# Altium project EECS498Converter.PrjPcb
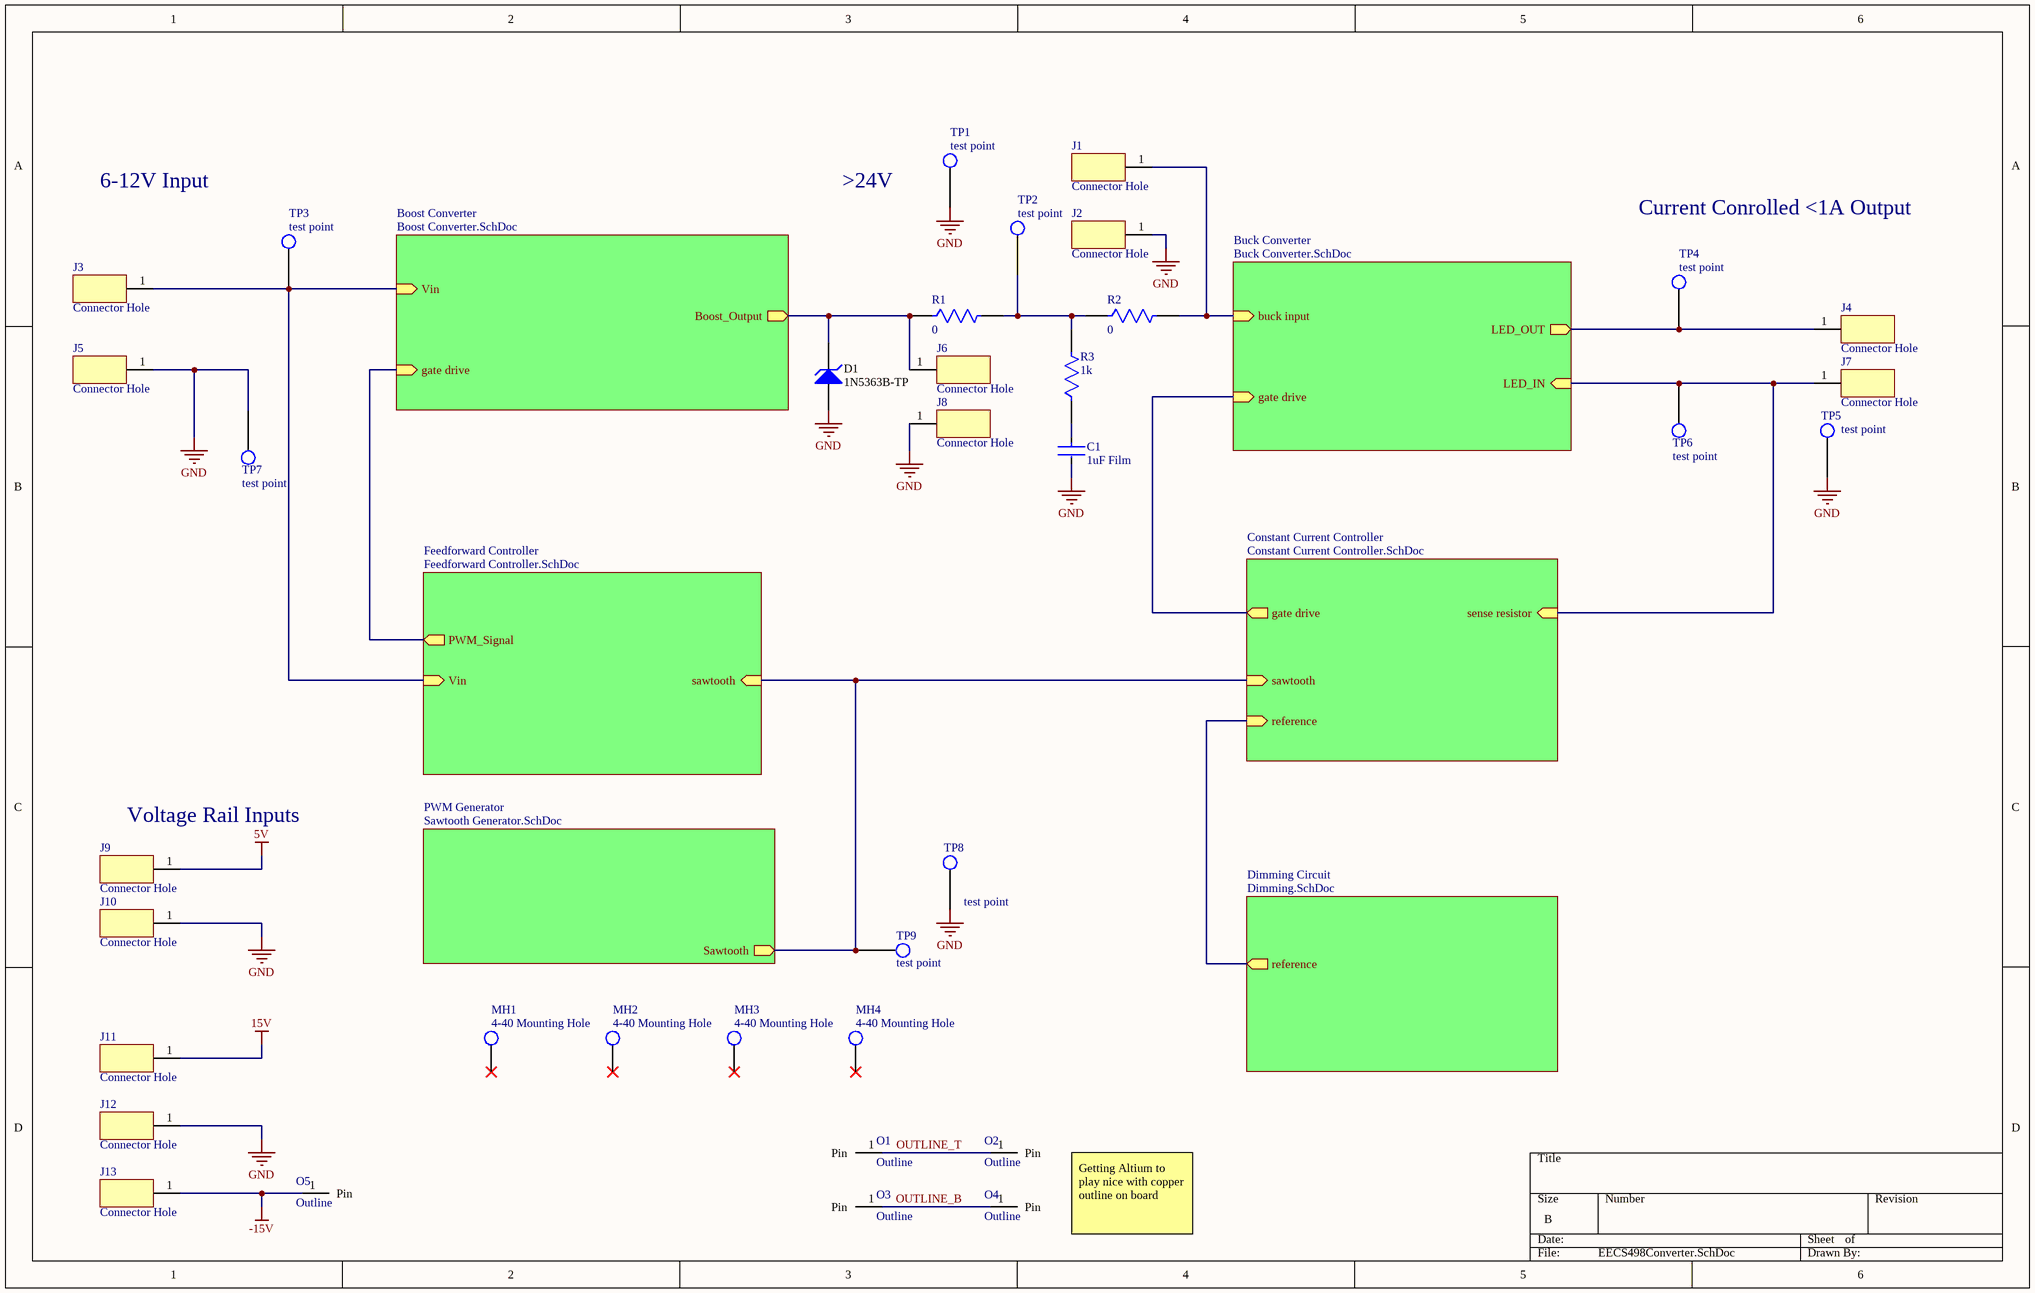
[diagram p0: EECS498Converter.SchDoc]
7 sheets, 148 parts. Net scope: hierarchical (ports join the sheet entries above them; power ports are global).
Board file: EECS498Converter.PcbDoc
Sheets:
  EECS498Converter.SchDoc
    Boost Converter = Boost Converter.SchDoc
    Buck Converter = Buck Converter.SchDoc
    Constant Current Controller = Constant Current Controller.SchDoc
    Feedforward Controller = Feedforward Controller.SchDoc
    Dimming Circuit = Dimming.SchDoc
    PWM Generator = Sawtooth Generator.SchDoc

## Sheet EECS498Converter.SchDoc
size B; SheetNumber: 1; SheetTotal: 7

### Parts
C1  1uF Film  [FP-FILM-CAP-10mm]
D1  1N5363B-TP  [1N5363B-TP]
J1  Connector Hole  [Connector Hole]
J2  Connector Hole  [Connector Hole]
J3  Connector Hole  [Connector Hole]
J4  Connector Hole  [Connector Hole]
J5  Connector Hole  [Connector Hole]
J6  Connector Hole  [Connector Hole]
J7  Connector Hole  [Connector Hole]
J8  Connector Hole  [Connector Hole]
J9  Connector Hole  [Connector Hole]
J10  Connector Hole  [Connector Hole]
J11  Connector Hole  [Connector Hole]
J12  Connector Hole  [Connector Hole]
J13  Connector Hole  [Connector Hole]
MH1  4-40 Mounting Hole  [4-40 Mounting Hole]
MH2  4-40 Mounting Hole  [4-40 Mounting Hole]
MH3  4-40 Mounting Hole  [4-40 Mounting Hole]
MH4  4-40 Mounting Hole  [4-40 Mounting Hole]
O1  Outline
O2  Outline
O3  Outline
O4  Outline
O5  Outline
R1  0  [FP-RLR07-MFG]
R2  0  [FP-RLR07-MFG]
R3  1k  [FP-RLR07-MFG]
TP1  test point  [test point]
TP2  test point  [test point]
TP3  test point  [test point]
TP4  test point  [test point]
TP5  test point  [test point]
TP6  test point  [test point]
TP7  test point  [test point]
TP8  test point  [test point]
TP9  test point  [test point]

### Sub-sheets
Boost Converter = Boost Converter.SchDoc: Vin (in), gate drive (in), Boost_Output (out)
Buck Converter = Buck Converter.SchDoc: buck input (in), gate drive (in), LED_IN (in), LED_OUT (out)
Constant Current Controller = Constant Current Controller.SchDoc: sense resistor (in), gate drive (out), reference (in), sawtooth (in)
Dimming Circuit = Dimming.SchDoc: reference (out)
Feedforward Controller = Feedforward Controller.SchDoc: Vin (in), PWM_Signal (out), sawtooth (in)
PWM Generator = Sawtooth Generator.SchDoc: Sawtooth (out)

### Nets
5V: J9.1
15V: J11.1
-15V: J13.1 O5.1(Pin)
GND: C1.2 D1.1(A) J2.1 J5.1 J8.1 J10.1 J12.1 TP1.1 TP5.1 TP7.1 TP8.1
OUTLINE_B: O3.1(Pin) O4.1(Pin)
OUTLINE_T: O1.1(Pin) O2.1(Pin)
NetC1_1: C1.1 R3.1
NetC2_1: J3.1 TP3.1 ; sheet Boost Converter/Vin, sheet Feedforward Controller/Vin
NetC3_1: D1.2(K) J6.1 R1.1 ; sheet Boost Converter/Boost_Output
NetC7_1: J4.1 TP4.1 ; sheet Buck Converter/LED_OUT
NetC7_2: J7.1 TP6.1 ; sheet Buck Converter/LED_IN, sheet Constant Current Controller/sense resistor
NetC32_1: sheet Constant Current Controller/reference, sheet Dimming Circuit/reference
NetJ1_1: J1.1 R2.2 ; sheet Buck Converter/buck input
NetR1_2: R1.2 R2.1 R3.2 TP2.1
NetR16_1: sheet Boost Converter/gate drive, sheet Feedforward Controller/PWM_Signal
NetR17_2: TP9.1 ; sheet Constant Current Controller/sawtooth, sheet Feedforward Controller/sawtooth, sheet PWM Generator/Sawtooth
NetR19_1: sheet Buck Converter/gate drive, sheet Constant Current Controller/gate drive

Not connected (* = marked no-connect by the designer): MH1 1*; MH2 1*; MH3 1*; MH4 1*

### Notes on the sheet
- 6-12V Input
- >24V
- Current Conrolled <1A Output
- (near J9) Voltage Rail Inputs
- Getting Altium to play nice with copper outline on board

### Library data of the parts
C1 = 1uf Capacitor: CAP CER 1UF 50V X7R FILM; Capacitance: 100nF; Tolerance: 10%; Dielectric Material: Ceramic; Lead Length: 30mm; Lead Diameter: 0.5mm; Lead/Base Style: Formed Leads; Diameter: 500um; Max Operating Temperature: 125°C; Case/Package: Dipped; Dielectric: X7R; Lead Free: Lead Free; Construction: RADIAL; Voltage: 50V; Thickness: 2.6mm; Min Operating Temperature: -55°C; Lead Pitch: 5mm; Height: 4mm; Radiation Hardening: No; Voltage Rating: 50V; Depth: 2.5mm; Voltage Rating (DC): 50V; Package Quantity: 1; Weight: 0.005644oz; Series: K; Mount: Through Hole; Termination: Radial; Height - Seated (Max): 0.257inch; Length: 4mm; Packaging: Tape and Reel; Width: 2.5mm; RoHS Compliant: Yes
D1 = 1N5363B-TP: Zener Diode 30V 5W THT; PartNumber: 1N4742A; Manufacturer: Fairchild Semiconductor; Tolerance: 5%; PD (W): 1; VZ (Min.) (V): 11.4; VZ (Max.) (V): 12.6; ZZ (Max) (ohm): 8; IR (uA): 5; Test Current IZ (mA): 21; PackageVersion: Rev. 2; DatasheetVersion: Rev. H3; Mounting Technology: Through Hole; PackageDescription: 2-Pin Axial leaded, Body 2.72 x 5.2 mm, Lead Spread 25.4 mm; ComponentLink1Description: Manufacturer URL; ComponentLink3Description: Package Specification; ComponentLink2Description: Datasheet; ComponentLink2URL: http://www.fairchildsemi.com/ds/1N/1N4744A.pdf; PackageReference: DO-41-2; RoHS: TRUE; Operating and Storage Temperature Range: -65 to 200 degC; ComponentLink3URL: http://www.fairchildsemi.com/dwg/DO/DO41A.pdf; ComponentLink1URL: http://www.fairchildsemi.com/
R1-R3 = Resistor: Resistor, ± 1%, 250 mW, Axial Leaded, Metal Film, Military Reliability; NexarPartId: 39453770; Max Power Dissipation: 250mW; Resistance: 100kΩ; Lead Length: 38.1mm; Voltage Rating: 250V; Lead Diameter: 640µm; Temperature Coefficient: 100ppm/°C; Wire/Cable Diameter: 50.8µm; Military Standard: MIL-PRF-39017; REACH SVHC: Unknown; Min Operating Temperature: -65°C; Length: 7.62mm; Case/Package: Axial; Lead Free: Contains Lead; Height: 2.5mm; Contact Plating: Lead, Tin; Radiation Hardening: No; Composition: Metal Film; Voltage Rating (DC): 250V; Schedule B: 8533210090, 8533210090|8533210090, 8533210090|8533210090|8533210090, 8533210090|8533210090|8533210090|8533210090; Diameter: 2.29mm; Tolerance: 1%; Max Operating Temperature: 150°C; Number of Terminations: 2; RoHS: Non-Compliant; Features: Military, Moisture Resistant, Weldable; Power Rating: 250mW; Packaging: Bulk; Width: 2.29mm; Termination: Axial; Failure Rate: 0.001%

## Sheet Boost Converter.SchDoc
size B; SheetNumber: 2; SheetTotal: 7
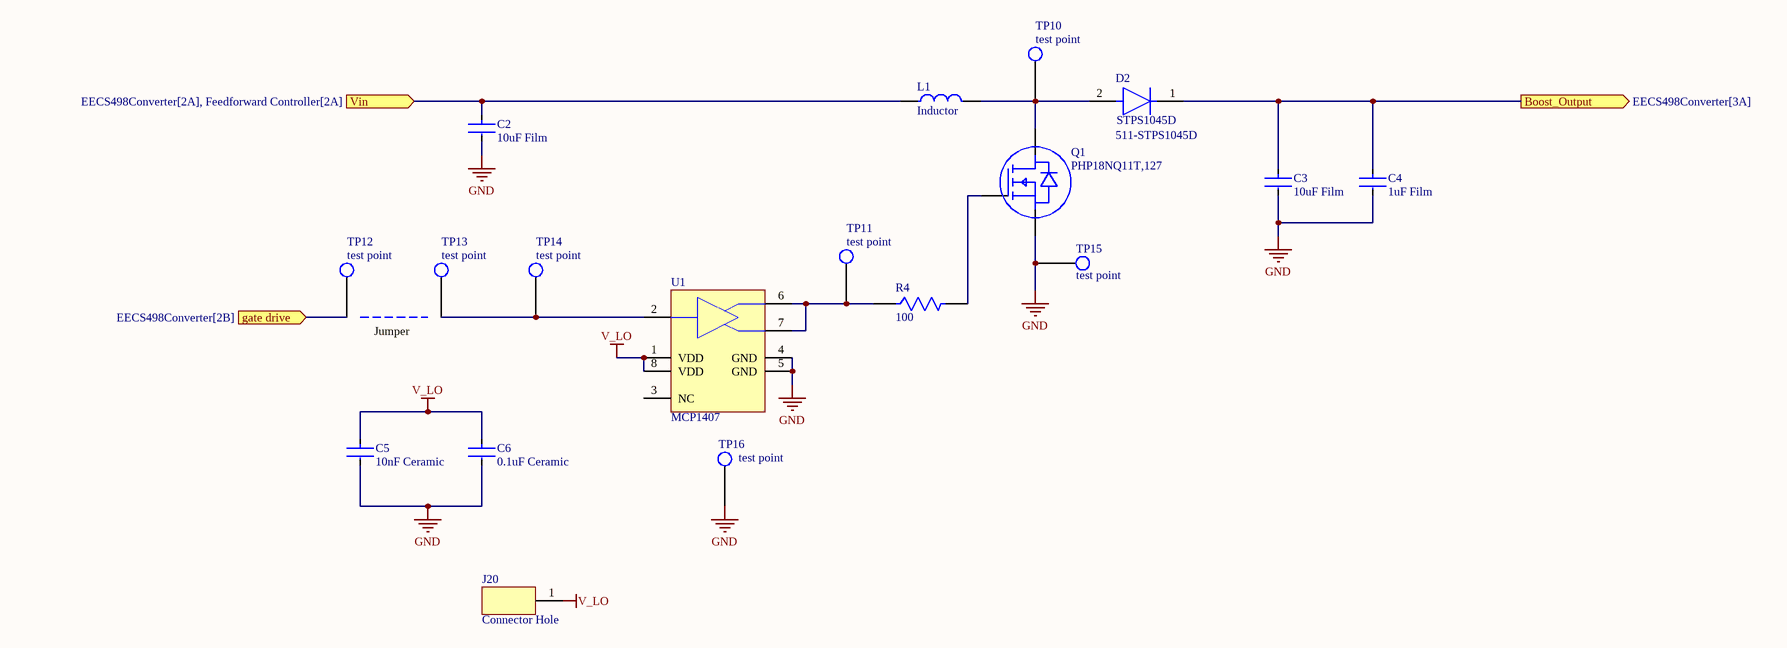
[diagram p1: Boost Converter.SchDoc]

### Parts
C2  10uF Film  [FP-FILM-CAP-22.5mm]
C3  10uF Film  [FP-FILM-CAP-22.5mm]
C4  1uF Film  [FP-FILM-CAP-10mm]
C5  10nF Ceramic  [FP-K15H5-MFG]
C6  0.1uF Ceramic  [FP-K15H5-MFG]
D2  STPS1045D  Supplier Part Number 1: 511-STPS1045D  [STPS1045D]
J20  Connector Hole  [Connector Hole]
L1  Inductor  [Power Inductor]
Q1  PHP18NQ11T,127  [1727-PHP18NQ11T,127-ND]
R4  100  [FP-RLR07-MFG]
TP10  test point  [test point]
TP11  test point  [test point]
TP12  test point  [test point]
TP13  test point  [test point]
TP14  test point  [test point]
TP15  test point  [test point]
TP16  test point  [test point]
U1  MCP1407  [DIP8]

### Ports
Boost_Output (out, see EECS498Converter[3A]), gate drive (in, see EECS498Converter[2B]), Vin (in, see EECS498Converter[2A], Feedforward Controller[2A])

### Nets
GND: C2.2 C3.2 C4.2 C5.2 C6.2 Q1.3(S) TP15.1 TP16.1 U1.4(GND) U1.5(GND)
V_LO: C5.1 C6.1 J20.1 U1.1(VDD) U1.8(VDD)
NetC2_1: C2.1 L1.1 ; port Vin
NetC3_1: C3.1 C4.1 D2.1(K) ; port Boost_Output
NetD2_2: D2.2(A) L1.2 Q1.2(D) TP10.1
NetQ1_1: Q1.1(G) R4.2
NetR4_1: R4.1 TP11.1 U1.6(OUT) U1.7(OUT)
NetR16_1: TP12.1 ; port gate drive
NetTP13_1: TP13.1 TP14.1 U1.2(IN)

Not connected (* = marked no-connect by the designer): U1 3(NC)

### Notes on the sheet
- Jumper

### Library data of the parts
C2 C3 = 10uF Capacitor: CAP CER 10UF 50V X7R FILM; Capacitance: 100nF; Tolerance: 10%; Dielectric Material: Ceramic; Lead Length: 30mm; Lead Diameter: 0.5mm; Lead/Base Style: Formed Leads; Diameter: 500um; Max Operating Temperature: 125°C; Case/Package: Dipped; Dielectric: X7R; Lead Free: Lead Free; Construction: RADIAL; Voltage: 50V; Thickness: 2.6mm; Min Operating Temperature: -55°C; Lead Pitch: 5mm; Height: 4mm; Radiation Hardening: No; Voltage Rating: 50V; Depth: 2.5mm; Voltage Rating (DC): 50V; Package Quantity: 1; Weight: 0.005644oz; Series: K; Mount: Through Hole; Termination: Radial; Height - Seated (Max): 0.257inch; Length: 4mm; Packaging: Tape and Reel; Width: 2.5mm; RoHS Compliant: Yes
C4 = 1uf Capacitor: as C1 on sheet EECS498Converter; Diameter: 500um; Max Operating Temperature: 125°C; Case/Package: Dipped; Dielectric: X7R; Lead Free: Lead Free; Construction: RADIAL; Voltage: 50V; Thickness: 2.6mm; Min Operating Temperature: -55°C; Lead Pitch: 5mm; Height: 4mm; Radiation Hardening: No; Voltage Rating: 50V; Depth: 2.5mm; Voltage Rating (DC): 50V; Package Quantity: 1; Weight: 0.005644oz; Series: K; Mount: Through Hole; Termination: Radial; Height - Seated (Max): 0.257inch; Length: 4mm; Packaging: Tape and Reel; Width: 2.5mm; RoHS Compliant: Yes
C5 = 10nF Capacitor: CAP CER 10nF 50V X7R RADIAL; Capacitance: 100nF; Tolerance: 10%; Lead Length: 30mm; Lead Diameter: 0.5mm; Lead/Base Style: Formed Leads; Diameter: 500um; Max Operating Temperature: 125°C; Dielectric Material: Ceramic; Case/Package: Dipped; Dielectric: X7R; Lead Free: Lead Free; Construction: RADIAL; Voltage: 50V; Thickness: 2.6mm; Min Operating Temperature: -55°C; Lead Pitch: 5mm; Height: 4mm; Radiation Hardening: No; Voltage Rating: 50V; Depth: 2.5mm; Voltage Rating (DC): 50V; Package Quantity: 1; Weight: 0.005644oz; Series: K; Mount: Through Hole; Termination: Radial; Height - Seated (Max): 0.257inch; Length: 4mm; Packaging: Tape and Reel; Width: 2.5mm; RoHS Compliant: Yes
C6 = 0.1uF Capacitor: CAP CER 0.1UF 50V X7R RADIAL; Capacitance: 100nF; Tolerance: 10%; Lead Length: 30mm; Lead Diameter: 0.5mm; Lead/Base Style: Formed Leads; Diameter: 500um; Max Operating Temperature: 125°C; Dielectric Material: Ceramic; Case/Package: Dipped; Dielectric: X7R; Lead Free: Lead Free; Construction: RADIAL; Voltage: 50V; Thickness: 2.6mm; Min Operating Temperature: -55°C; Lead Pitch: 5mm; Height: 4mm; Radiation Hardening: No; Voltage Rating: 50V; Depth: 2.5mm; Voltage Rating (DC): 50V; Package Quantity: 1; Weight: 0.005644oz; Series: K; Mount: Through Hole; Termination: Radial; Height - Seated (Max): 0.257inch; Length: 4mm; Packaging: Tape and Reel; Width: 2.5mm; RoHS Compliant: Yes
D2 = STPS1045D: Diode 45 V 10A Through Hole TO-220AC; Supplier 1: Mouser
L1 = Inductor: DC Current: 180mA; Tolerance: 10%; Core Material: Ferrite; Q Factor: 27; Self Resonant Frequency: 25MHz; Shielding: Unshielded; Test Frequency: 1MHz; Inductance: 10uH; Series Resistance: 1.6R; Radiation Hardening: No; REACH SVHC: No SVHC; Width: 0.098inch; RoHS Compliant: Yes; Case/Package: 1210; Package Quantity: 2000; Height - Seated (Max): 0.083inch; Rated Current-Max: 180mA; Series: SIMID; Mount: Surface Mount; Depth: 2.8mm; Resistor Type: Wirewound; Max DC Current: 180mA; Termination: SMD/SMT; Contact Plating: Tin; Height: 2.1mm; Case Code (Metric): 3225; Lead Free: Lead Free; Weight: 0.001764oz; Max Operating Temperature: 125°C; Length: 3.5mm; Packaging: Tape and Reel; Case Code (Imperial): 1210; Inductance Tolerance: 10%; Ratings: AEC-Q200; Number of Pins: 2; Current Rating: 180mA; Military Standard: Not; DC Resistance (DCR): 1.6R
Q1 = PHP18NQ11T,127: N-Channel 110 V 18A (Tc) 79W (Tc) Through Hole TO-220AB; Supplier 1: Digi-Key; Supplier Part Number 1: 1727-PHP18NQ11T,127-ND
R4 = Resistor: as R1 on sheet EECS498Converter; Military Standard: MIL-PRF-39017; REACH SVHC: Unknown; Min Operating Temperature: -65°C; Length: 7.62mm; Case/Package: Axial; Lead Free: Contains Lead; Height: 2.5mm; Contact Plating: Lead, Tin; Radiation Hardening: No; Composition: Metal Film; Voltage Rating (DC): 250V; Schedule B: 8533210090, 8533210090|8533210090, 8533210090|8533210090|8533210090, 8533210090|8533210090|8533210090|8533210090; Diameter: 2.29mm; Tolerance: 1%; Max Operating Temperature: 150°C; Number of Terminations: 2; RoHS: Non-Compliant; Features: Military, Moisture Resistant, Weldable; Power Rating: 250mW; Packaging: Bulk; Width: 2.29mm; Termination: Axial; Failure Rate: 0.001%
U1 = MCP1407: 6A High-Speed Power MOSFET Drivers, Non Inverting, Extended Temperature; PackageVersion: revBB, Aug-2009; PackageReference: PDIP300-P8; Code_JEDEC: MS-001; PackageDescription: 8-Lead Plastic Dual In-Line (P) - 300 mil Body [PDIP]; DatasheetVersion: revA, Dec-2006

## Sheet Buck Converter.SchDoc
size B; SheetNumber: 3; SheetTotal: 7
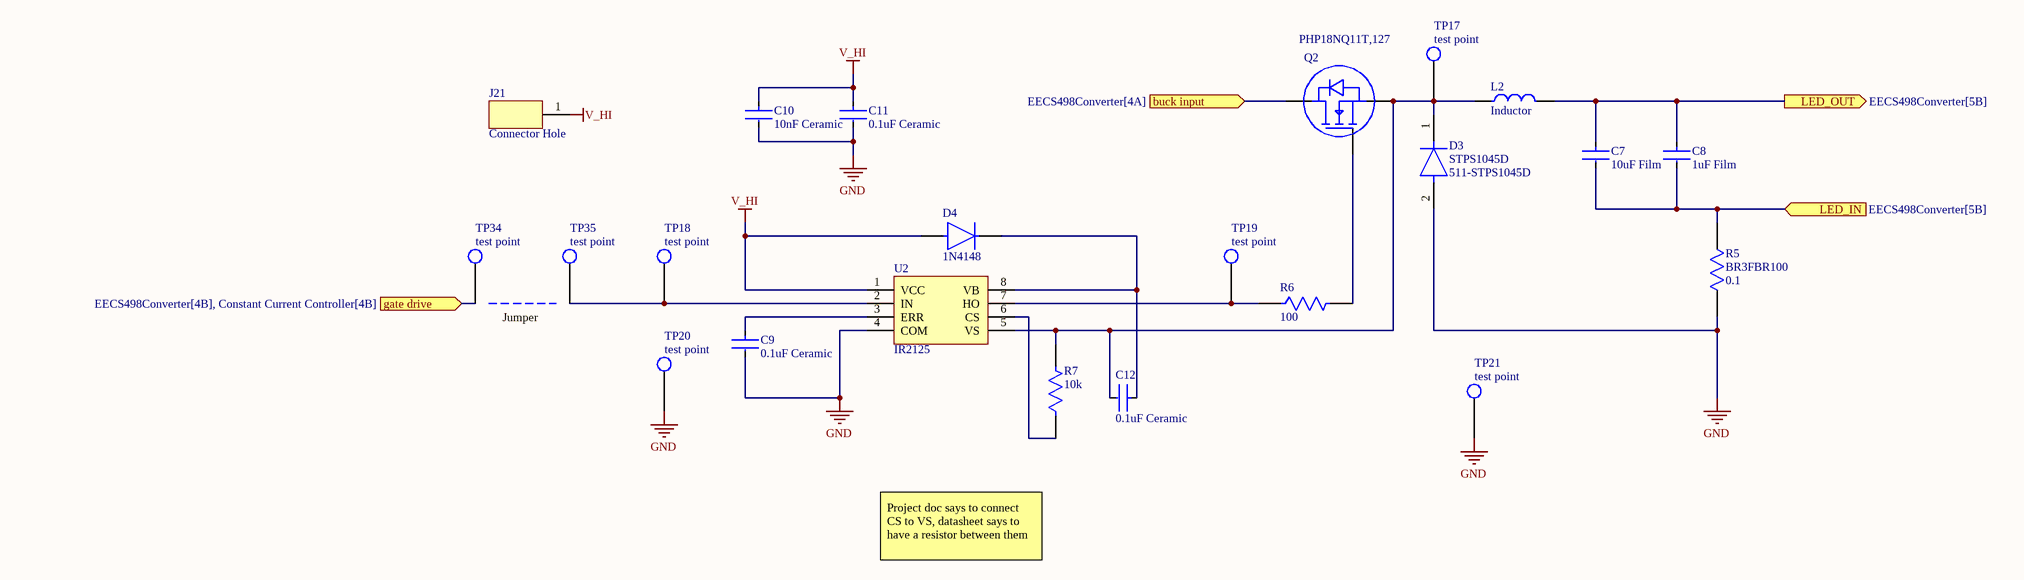
[diagram p2: Buck Converter.SchDoc]

### Parts
C7  10uF Film  [FP-FILM-CAP-22.5mm]
C8  1uF Film  [FP-FILM-CAP-10mm]
C9  0.1uF Ceramic  [FP-K15H5-MFG]
C10  10nF Ceramic  [FP-K15H5-MFG]
C11  0.1uF Ceramic  [FP-K15H5-MFG]
C12  0.1uF Ceramic  [FP-K15H5-MFG]
D3  STPS1045D  Supplier Part Number 1: 511-STPS1045D  [STPS1045D]
D4  1N4148  [FP-1N4148-MFG]
J21  Connector Hole  [Connector Hole]
L2  Inductor  [Power Inductor]
Q2  PHP18NQ11T,127  [1727-PHP18NQ11T,127-ND]
R5  BR3FBR100  value 0.1  [BR3FBR100]
R6  100  [FP-RLR07-MFG]
R7  10k  [FP-RLR07-MFG]
TP17  test point  [test point]
TP18  test point  [test point]
TP19  test point  [test point]
TP20  test point  [test point]
TP21  test point  [test point]
TP34  test point  [test point]
TP35  test point  [test point]
U2  IR2125  [DIP8]

### Ports
buck input (in, see EECS498Converter[4A]), gate drive (in, see EECS498Converter[4B], Constant Current Controller[4B]), LED_IN (in, see EECS498Converter[5B]), LED_OUT (out, see EECS498Converter[5B])

### Nets
GND: C9.2 C10.2 C11.2 D3.2(A) R5.1 TP20.1 TP21.1 U2.4(COM)
V_HI: C10.1 C11.1 D4.2(A) J21.1 U2.1(VCC)
NetC7_1: C7.1 C8.1 L2.2 ; port LED_OUT
NetC7_2: C7.2 C8.2 R5.2 ; port LED_IN
NetC9_1: C9.1 U2.3(ERR)
NetC12_1: C12.1 D4.1(C) U2.8(VB)
NetC12_2: C12.2 D3.1(K) L2.1 Q2.3(S) R7.2 TP17.1 U2.5(VS)
NetJ1_1: Q2.2(D) ; port buck input
NetQ2_1: Q2.1(G) R6.2
NetR6_1: R6.1 TP19.1 U2.7(HO)
NetR7_1: R7.1 U2.6(CS)
NetR19_1: TP34.1 ; port gate drive
NetTP18_1: TP18.1 TP35.1 U2.2(IN)

### Notes on the sheet
- Jumper
- Project doc says to connect CS to VS, datasheet says to have a resistor between them

### Library data of the parts
C7 = 10uF Capacitor: as C2 on sheet Boost Converter; Diameter: 500um; Max Operating Temperature: 125°C; Case/Package: Dipped; Dielectric: X7R; Lead Free: Lead Free; Construction: RADIAL; Voltage: 50V; Thickness: 2.6mm; Min Operating Temperature: -55°C; Lead Pitch: 5mm; Height: 4mm; Radiation Hardening: No; Voltage Rating: 50V; Depth: 2.5mm; Voltage Rating (DC): 50V; Package Quantity: 1; Weight: 0.005644oz; Series: K; Mount: Through Hole; Termination: Radial; Height - Seated (Max): 0.257inch; Length: 4mm; Packaging: Tape and Reel; Width: 2.5mm; RoHS Compliant: Yes
C8 = 1uf Capacitor: as C1 on sheet EECS498Converter; Diameter: 500um; Max Operating Temperature: 125°C; Case/Package: Dipped; Dielectric: X7R; Lead Free: Lead Free; Construction: RADIAL; Voltage: 50V; Thickness: 2.6mm; Min Operating Temperature: -55°C; Lead Pitch: 5mm; Height: 4mm; Radiation Hardening: No; Voltage Rating: 50V; Depth: 2.5mm; Voltage Rating (DC): 50V; Package Quantity: 1; Weight: 0.005644oz; Series: K; Mount: Through Hole; Termination: Radial; Height - Seated (Max): 0.257inch; Length: 4mm; Packaging: Tape and Reel; Width: 2.5mm; RoHS Compliant: Yes
C9 C11 C12 = 0.1uF Capacitor: as C6 on sheet Boost Converter; Diameter: 500um; Max Operating Temperature: 125°C; Dielectric Material: Ceramic; Case/Package: Dipped; Dielectric: X7R; Lead Free: Lead Free; Construction: RADIAL; Voltage: 50V; Thickness: 2.6mm; Min Operating Temperature: -55°C; Lead Pitch: 5mm; Height: 4mm; Radiation Hardening: No; Voltage Rating: 50V; Depth: 2.5mm; Voltage Rating (DC): 50V; Package Quantity: 1; Weight: 0.005644oz; Series: K; Mount: Through Hole; Termination: Radial; Height - Seated (Max): 0.257inch; Length: 4mm; Packaging: Tape and Reel; Width: 2.5mm; RoHS Compliant: Yes
C10 = 10nF Capacitor: as C5 on sheet Boost Converter; Diameter: 500um; Max Operating Temperature: 125°C; Dielectric Material: Ceramic; Case/Package: Dipped; Dielectric: X7R; Lead Free: Lead Free; Construction: RADIAL; Voltage: 50V; Thickness: 2.6mm; Min Operating Temperature: -55°C; Lead Pitch: 5mm; Height: 4mm; Radiation Hardening: No; Voltage Rating: 50V; Depth: 2.5mm; Voltage Rating (DC): 50V; Package Quantity: 1; Weight: 0.005644oz; Series: K; Mount: Through Hole; Termination: Radial; Height - Seated (Max): 0.257inch; Length: 4mm; Packaging: Tape and Reel; Width: 2.5mm; RoHS Compliant: Yes
D3 = STPS1045D: Diode 45 V 10A Through Hole TO-220AC; Supplier 1: Mouser
D4 = 1N4148: DIODE GEN PURP 100V 200MA DO35; Forward Voltage: 1V; Max Power Dissipation: 500mW; Max Reverse Current: 5uA; Forward Current: 300mA; Current: 4A; Reverse Recovery Time: 4ns; Element Configuration: Single; Outside Diameter: 1.85mm; Capacitance: 4pF; Polarity: Standard; Max Forward Surge Current (Ifsm): 1A; Reverse Voltage: 100V; Output Current: 200mA; Average Rectified Current: 200mA; Diameter: 1.91mm; Max Repetitive Reverse Voltage (Vrrm): 100V; Current Rating: 200mA; Case/Package: DO-35; Lead Free: Lead Free; Number of Pins: 2; Recovery Time: 4ns; Packaging: Bulk; Contact Plating: Tin; Voltage: 100V; Mount: Through Hole; Max Surge Current: 4A; Package Quantity: 2000; Width: 1.91mm; Max Reverse Voltage (DC): 100V; Length: 4.56mm; Radiation Hardening: No; Power Dissipation: 500mW; Voltage Rating (DC): 100V; Peak Non-Repetitive Surge Current: 4A; REACH SVHC: No SVHC; Height: 4.56mm; Max Operating Temperature: 175°C; Series: -; Weight: 0.01lb; Min Operating Temperature: -65°C
L2 = Inductor: as L1 on sheet Boost Converter; Radiation Hardening: No; REACH SVHC: No SVHC; Width: 0.098inch; RoHS Compliant: Yes; Case/Package: 1210; Package Quantity: 2000; Height - Seated (Max): 0.083inch; Rated Current-Max: 180mA; Series: SIMID; Mount: Surface Mount; Depth: 2.8mm; Resistor Type: Wirewound; Max DC Current: 180mA; Termination: SMD/SMT; Contact Plating: Tin; Height: 2.1mm; Case Code (Metric): 3225; Lead Free: Lead Free; Weight: 0.001764oz; Max Operating Temperature: 125°C; Length: 3.5mm; Packaging: Tape and Reel; Case Code (Imperial): 1210; Inductance Tolerance: 10%; Ratings: AEC-Q200; Number of Pins: 2; Current Rating: 180mA; Military Standard: Not; DC Resistance (DCR): 1.6R
Q2 = PHP18NQ11T,127: as Q1 on sheet Boost Converter; Supplier 1: Digi-Key; Supplier Part Number 1: 1727-PHP18NQ11T,127-ND
R5 = BR3FBR100: 100 mOhms ±1% 3W Through Hole Resistor Radial Current Sense, Flame Proof, Non-Inductive, Pulse Withstanding, Safety Metal Foil; Supplier 1: Future Electronics; Supplier Part Number 1: 7170987
R6 R7 = Resistor: as R1 on sheet EECS498Converter; Military Standard: MIL-PRF-39017; REACH SVHC: Unknown; Min Operating Temperature: -65°C; Length: 7.62mm; Case/Package: Axial; Lead Free: Contains Lead; Height: 2.5mm; Contact Plating: Lead, Tin; Radiation Hardening: No; Composition: Metal Film; Voltage Rating (DC): 250V; Schedule B: 8533210090, 8533210090|8533210090, 8533210090|8533210090|8533210090, 8533210090|8533210090|8533210090|8533210090; Diameter: 2.29mm; Tolerance: 1%; Max Operating Temperature: 150°C; Number of Terminations: 2; RoHS: Non-Compliant; Features: Military, Moisture Resistant, Weldable; Power Rating: 250mW; Packaging: Bulk; Width: 2.29mm; Termination: Axial; Failure Rate: 0.001%
U2 = IR2125: High-Side Gate Driver IC Non-Inverting 8-PDIP; Supplier 1: Allied Electronics; Supplier Part Number 1: 70017143

## Sheet Constant Current Controller.SchDoc
size B; SheetNumber: 6; SheetTotal: 7
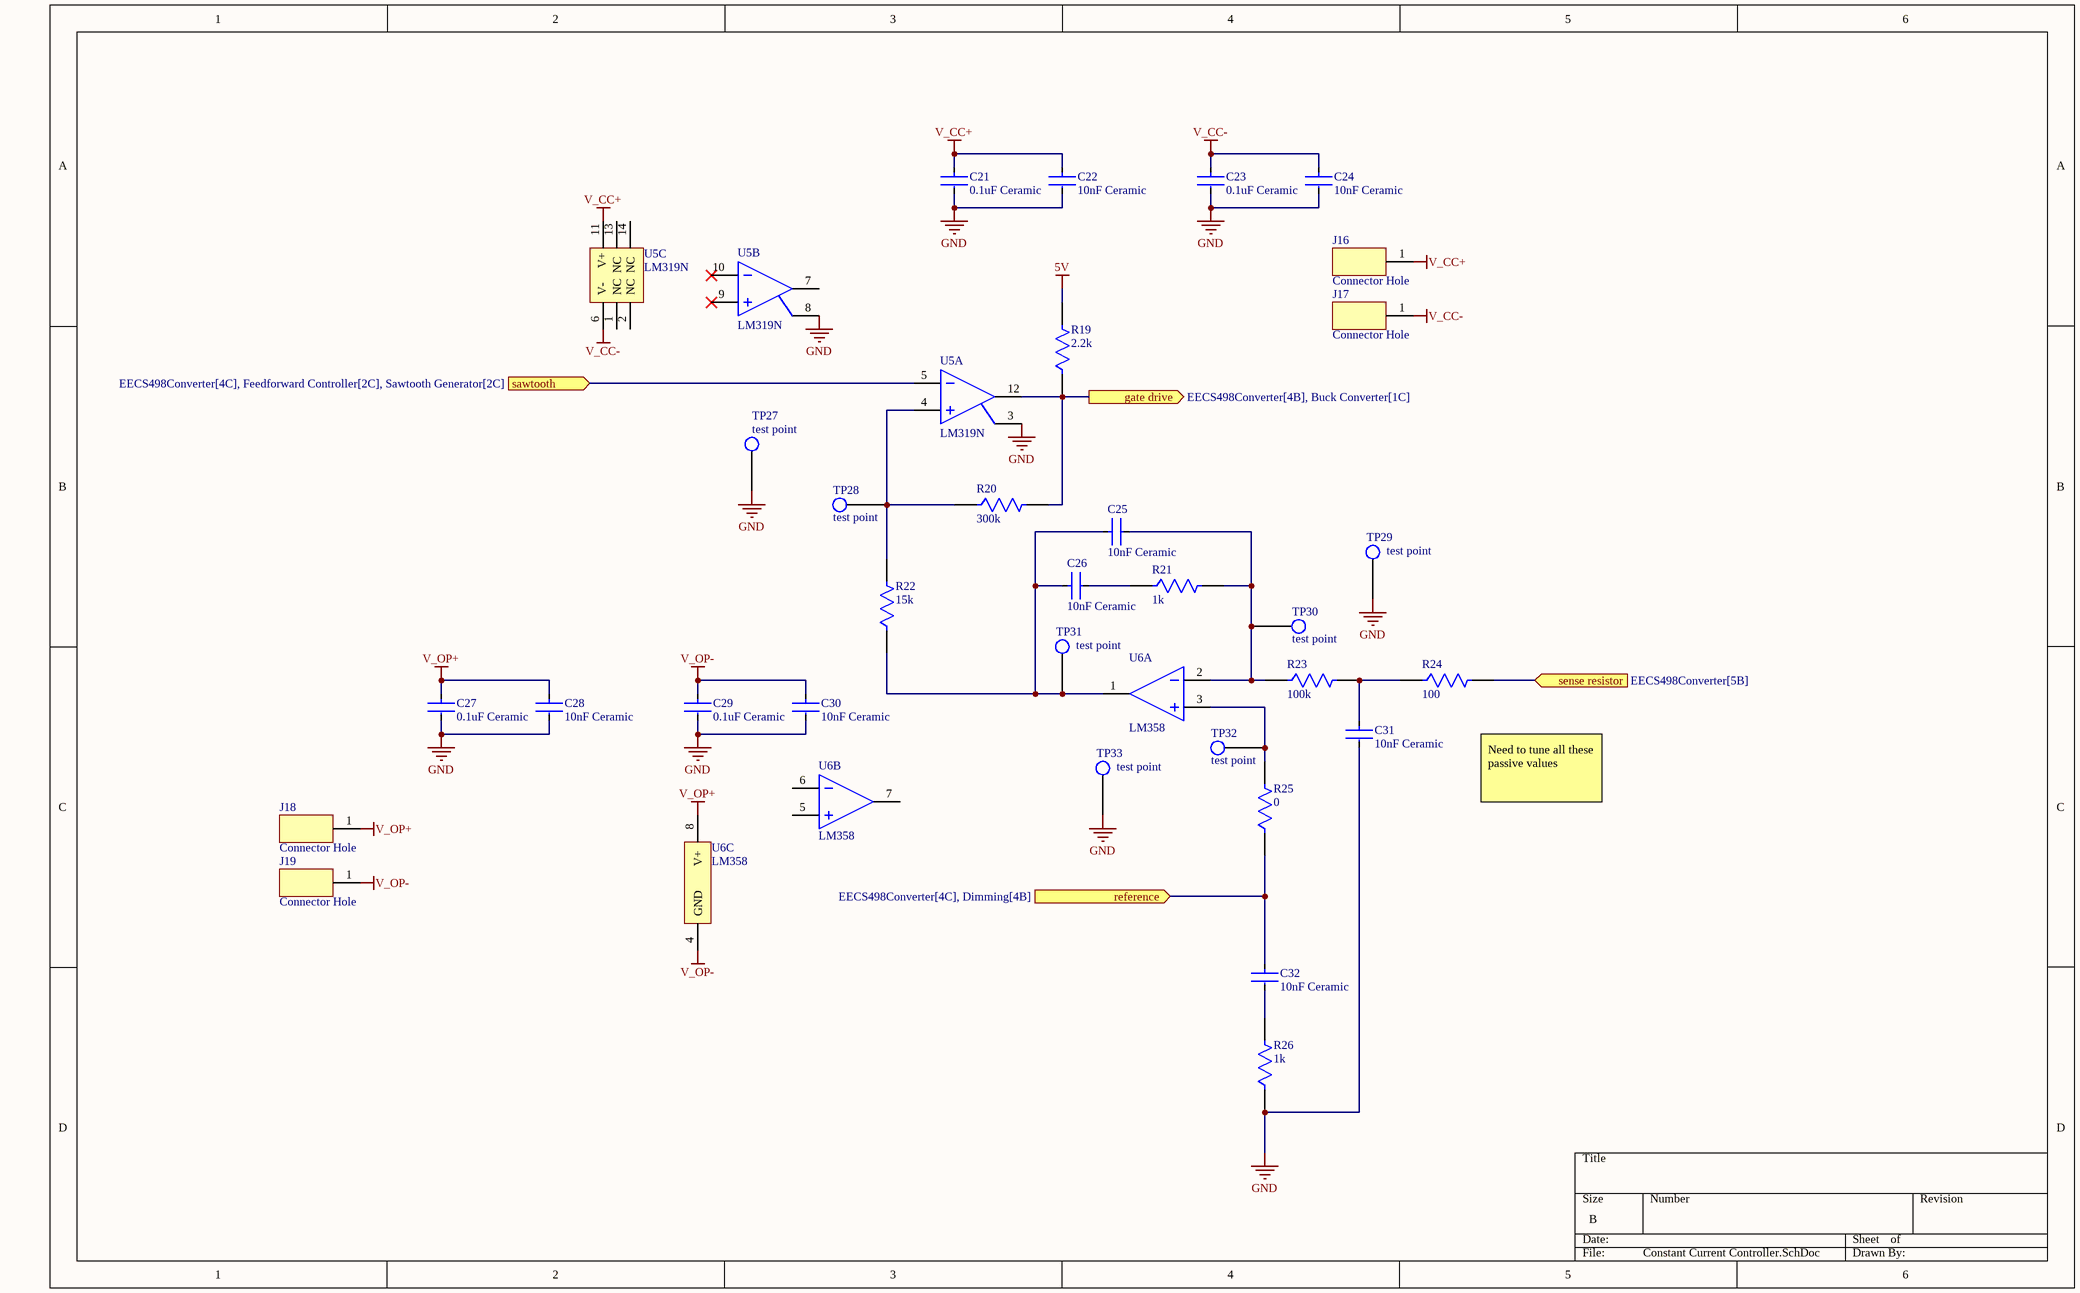
[diagram p3: Constant Current Controller.SchDoc]

### Parts
C21  0.1uF Ceramic  [FP-K15H5-MFG]
C22  10nF Ceramic  [FP-K15H5-MFG]
C23  0.1uF Ceramic  [FP-K15H5-MFG]
C24  10nF Ceramic  [FP-K15H5-MFG]
C25  10nF Ceramic  [FP-K15H5-MFG]
C26  10nF Ceramic  [FP-K15H5-MFG]
C27  0.1uF Ceramic  [FP-K15H5-MFG]
C28  10nF Ceramic  [FP-K15H5-MFG]
C29  0.1uF Ceramic  [FP-K15H5-MFG]
C30  10nF Ceramic  [FP-K15H5-MFG]
C31  10nF Ceramic  [FP-K15H5-MFG]
C32  10nF Ceramic  [FP-K15H5-MFG]
J16  Connector Hole  [Connector Hole]
J17  Connector Hole  [Connector Hole]
J18  Connector Hole  [Connector Hole]
J19  Connector Hole  [Connector Hole]
R19  2.2k  [FP-RLR07-MFG]
R20  300k  [FP-RLR07-MFG]
R21  1k  [FP-RLR07-MFG]
R22  15k  [FP-RLR07-MFG]
R23  100k  [FP-RLR07-MFG]
R24  100  [FP-RLR07-MFG]
R25  0  [FP-RLR07-MFG]
R26  1k  [FP-RLR07-MFG]
TP27  test point  [test point]
TP28  test point  [test point]
TP29  test point  [test point]
TP30  test point  [test point]
TP31  test point  [test point]
TP32  test point  [test point]
TP33  test point  [test point]
U5  LM319N  [LM319_DIP14]  (parts A,B,C of 3)
U6  LM358  [DIP8]  (parts A,B,C of 3)

### Ports
gate drive (out, see EECS498Converter[4B], Buck Converter[1C]), reference (in, see EECS498Converter[4C], Dimming[4B]), sawtooth (in, see EECS498Converter[4C], Feedforward Controller[2C], Sawtooth Generator[2C]), sense resistor (in, see EECS498Converter[5B])

### Nets
5V: R19.2
GND: C21.2 C22.2 C23.2 C24.2 C27.2 C28.2 C29.2 C30.2 C31.2 R26.1 TP27.1 TP29.1 TP33.1 U5.3(GND1) U5.8(GND2)
V_CC+: C21.1 C22.1 J16.1 U5.11(V+)
V_CC-: C23.1 C24.1 J17.1 U5.6(V-)
V_OP+: C27.1 C28.1 J18.1 U6.8(V+)
V_OP-: C29.1 C30.1 J19.1 U6.4(GND)
NetC7_2: R24.2 ; port sense resistor
NetC25_1: C25.1 C26.1 R22.1 TP31.1 U6.1(OUTA)
NetC25_2: C25.2 R21.2 R23.1 TP30.1 U6.2(INA-)
NetC26_2: C26.2 R21.1
NetC31_1: C31.1 R23.2 R24.1
NetC32_1: C32.1 R25.1 ; port reference
NetC32_2: C32.2 R26.2
NetR17_2: U5.5(IN1-) ; port sawtooth
NetR19_1: R19.1 R20.2 U5.12(OUT1) ; port gate drive
NetR20_1: R20.1 R22.2 TP28.1 U5.4(IN1+)
NetR25_2: R25.2 TP32.1 U6.3(INA+)

Not connected (* = marked no-connect by the designer): U5 1(NC) 2(NC) 7(OUT2) 9(IN2+)* 10(IN2-)* 13(NC) 14(NC); U6 5(INB+) 6(INB-) 7(OUTB)

### Notes on the sheet
- Need to tune all these passive values

### Library data of the parts
C21 C23 C27 C29 = 0.1uF Capacitor: as C6 on sheet Boost Converter; Diameter: 500um; Max Operating Temperature: 125°C; Dielectric Material: Ceramic; Case/Package: Dipped; Dielectric: X7R; Lead Free: Lead Free; Construction: RADIAL; Voltage: 50V; Thickness: 2.6mm; Min Operating Temperature: -55°C; Lead Pitch: 5mm; Height: 4mm; Radiation Hardening: No; Voltage Rating: 50V; Depth: 2.5mm; Voltage Rating (DC): 50V; Package Quantity: 1; Weight: 0.005644oz; Series: K; Mount: Through Hole; Termination: Radial; Height - Seated (Max): 0.257inch; Length: 4mm; Packaging: Tape and Reel; Width: 2.5mm; RoHS Compliant: Yes
C22 C24-C26 C28 C30-C32 = 10nF Capacitor: as C5 on sheet Boost Converter; Diameter: 500um; Max Operating Temperature: 125°C; Dielectric Material: Ceramic; Case/Package: Dipped; Dielectric: X7R; Lead Free: Lead Free; Construction: RADIAL; Voltage: 50V; Thickness: 2.6mm; Min Operating Temperature: -55°C; Lead Pitch: 5mm; Height: 4mm; Radiation Hardening: No; Voltage Rating: 50V; Depth: 2.5mm; Voltage Rating (DC): 50V; Package Quantity: 1; Weight: 0.005644oz; Series: K; Mount: Through Hole; Termination: Radial; Height - Seated (Max): 0.257inch; Length: 4mm; Packaging: Tape and Reel; Width: 2.5mm; RoHS Compliant: Yes
R19-R26 = Resistor: as R1 on sheet EECS498Converter; Military Standard: MIL-PRF-39017; REACH SVHC: Unknown; Min Operating Temperature: -65°C; Length: 7.62mm; Case/Package: Axial; Lead Free: Contains Lead; Height: 2.5mm; Contact Plating: Lead, Tin; Radiation Hardening: No; Composition: Metal Film; Voltage Rating (DC): 250V; Schedule B: 8533210090, 8533210090|8533210090, 8533210090|8533210090|8533210090, 8533210090|8533210090|8533210090|8533210090; Diameter: 2.29mm; Tolerance: 1%; Max Operating Temperature: 150°C; Number of Terminations: 2; RoHS: Non-Compliant; Features: Military, Moisture Resistant, Weldable; Power Rating: 250mW; Packaging: Bulk; Width: 2.29mm; Termination: Axial; Failure Rate: 0.001%
U5 = LM319N: High Speed Dual Comparator, 14-pin MDIP; Manufacturer: Texas Instruments; PowerWise: N; PackageTopMarking: NSUZXYYTTE#*LM319N; CompType: Amplifiers; ComponentLink1Description: Datasheet URL; PinCount: 14; PackageDescription: MDIP, .750 x .250 x.130in, 14 Lead, .100in Pitch; ComponentLink1URL: http://www.ti.com/general/docs/lit/getliterature.tsp?genericPartNumber=LM319-N&fileType=pdf; Package Reference: NFF0014A; RoHS: N; Code_JEDEC: MS-001-AA
U6 = LM358: Low Power Dual Operational Amplifier, 8-pin MDIP, Pb-Free; Manufacturer: Texas Instruments; PowerWise: N; PackageTopMarking: NSUZXYTTE#*LM*358N; CompType: Amplifiers; Package Reference: P0008A; PinCount: 8; ComponentLink1URL: http://www.ti.com/general/docs/lit/getliterature.tsp?genericPartNumber=LM358-N&fileType=pdf; Code_JEDEC: MS-001-BA; PackageDescription: MDIP, .365 x .250 x .130in, 8 Lead, .100in Pitch; RoHS: Y; ComponentLink1Description: Datasheet URL

## Sheet Feedforward Controller.SchDoc
size B; SheetNumber: 5; SheetTotal: 7
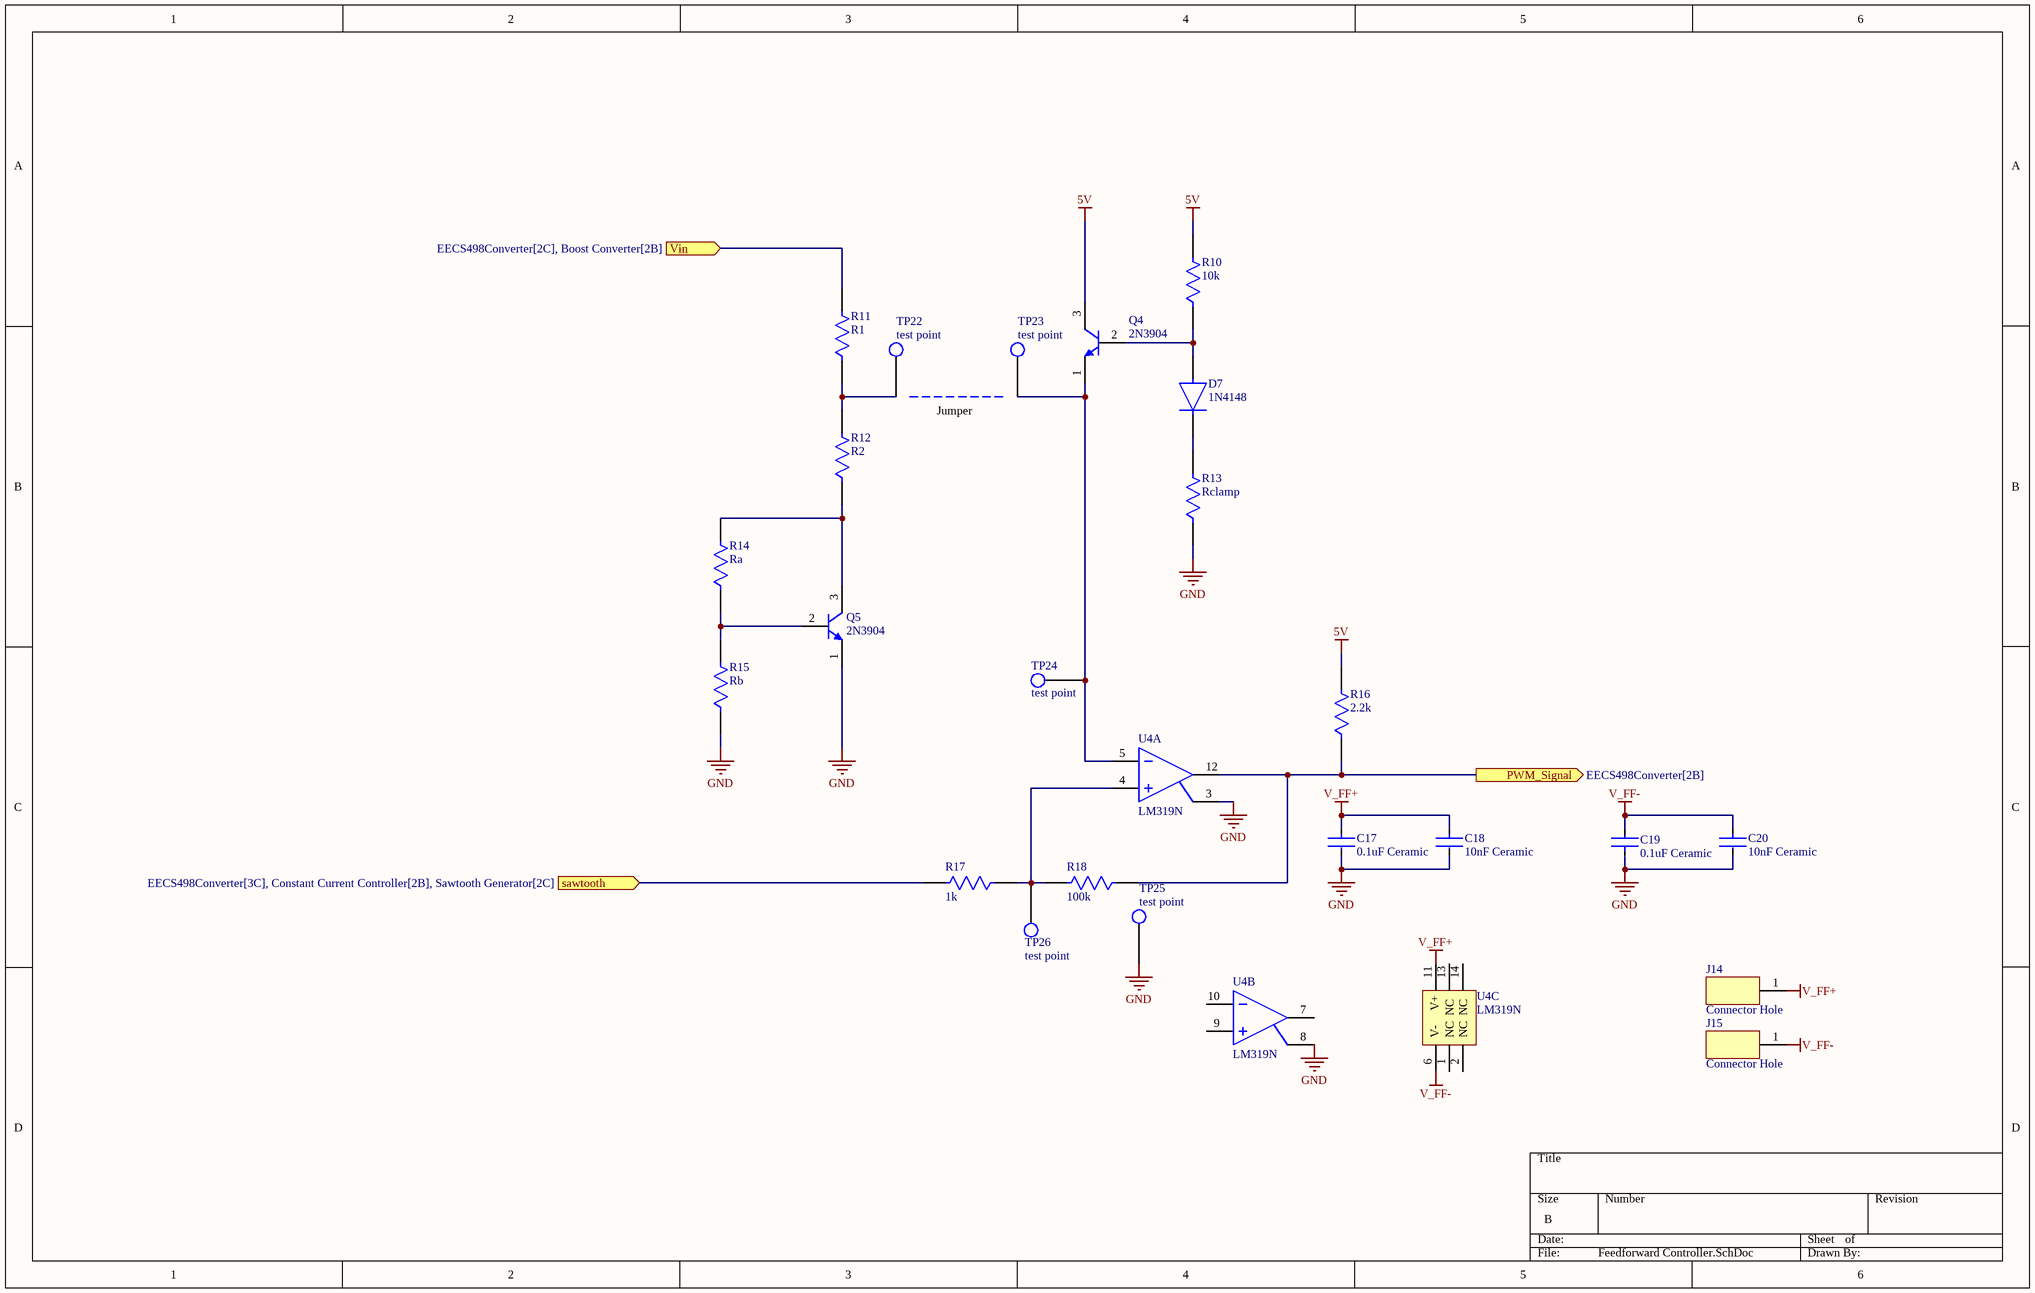
[diagram p4: Feedforward Controller.SchDoc]

### Parts
C17  0.1uF Ceramic  [FP-K15H5-MFG]
C18  10nF Ceramic  [FP-K15H5-MFG]
C19  0.1uF Ceramic  [FP-K15H5-MFG]
C20  10nF Ceramic  [FP-K15H5-MFG]
D7  1N4148  [FP-1N4148-MFG]
J14  Connector Hole  [Connector Hole]
J15  Connector Hole  [Connector Hole]
Q4  2N3904  [2N3906TF]
Q5  2N3904  [2N3906TF]
R10  10k  [FP-RLR07-MFG]
R11  R1  [FP-RLR07-MFG]
R12  R2  [FP-RLR07-MFG]
R13  Rclamp  [FP-RLR07-MFG]
R14  Ra  [FP-RLR07-MFG]
R15  Rb  [FP-RLR07-MFG]
R16  2.2k  [FP-RLR07-MFG]
R17  1k  [FP-RLR07-MFG]
R18  100k  [FP-RLR07-MFG]
TP22  test point  [test point]
TP23  test point  [test point]
TP24  test point  [test point]
TP25  test point  [test point]
TP26  test point  [test point]
U4  LM319N  [LM319_DIP14]  (parts A,B,C of 3)

### Ports
PWM_Signal (out, see EECS498Converter[2B]), sawtooth (in, see EECS498Converter[3C], Constant Current Controller[2B], Sawtooth Generator[2C]), Vin (in, see EECS498Converter[2C], Boost Converter[2B])

### Nets
5V: Q4.3(C) R10.2 R16.2
GND: C17.2 C18.2 C19.1 C20.2 Q5.1(E) R13.1 R15.1 TP25.1 U4.3(GND1) U4.8(GND2)
V_FF+: C17.1 C18.1 J14.1 U4.11(V+)
V_FF-: C19.2 C20.1 J15.1 U4.6(V-)
NetC2_1: R11.2 ; port Vin
NetD7_1: D7.1(C) R13.2
NetD7_2: D7.2(A) Q4.2(B) R10.1
NetQ4_1: Q4.1(E) TP23.1 TP24.1 U4.5(IN1-)
NetQ5_2: Q5.2(B) R14.1 R15.2
NetQ5_3: Q5.3(C) R12.1 R14.2
NetR11_1: R11.1 R12.2 TP22.1
NetR16_1: R16.1 R18.1 U4.12(OUT1) ; port PWM_Signal
NetR17_1: R17.1 R18.2 TP26.1 U4.4(IN1+)
NetR17_2: R17.2 ; port sawtooth

Not connected (* = marked no-connect by the designer): U4 1(NC) 2(NC) 7(OUT2) 9(IN2+) 10(IN2-) 13(NC) 14(NC)

### Notes on the sheet
- Jumper

### Library data of the parts
C17 C19 = 0.1uF Capacitor: as C6 on sheet Boost Converter; Diameter: 500um; Max Operating Temperature: 125°C; Dielectric Material: Ceramic; Case/Package: Dipped; Dielectric: X7R; Lead Free: Lead Free; Construction: RADIAL; Voltage: 50V; Thickness: 2.6mm; Min Operating Temperature: -55°C; Lead Pitch: 5mm; Height: 4mm; Radiation Hardening: No; Voltage Rating: 50V; Depth: 2.5mm; Voltage Rating (DC): 50V; Package Quantity: 1; Weight: 0.005644oz; Series: K; Mount: Through Hole; Termination: Radial; Height - Seated (Max): 0.257inch; Length: 4mm; Packaging: Tape and Reel; Width: 2.5mm; RoHS Compliant: Yes
C18 C20 = 10nF Capacitor: as C5 on sheet Boost Converter; Diameter: 500um; Max Operating Temperature: 125°C; Dielectric Material: Ceramic; Case/Package: Dipped; Dielectric: X7R; Lead Free: Lead Free; Construction: RADIAL; Voltage: 50V; Thickness: 2.6mm; Min Operating Temperature: -55°C; Lead Pitch: 5mm; Height: 4mm; Radiation Hardening: No; Voltage Rating: 50V; Depth: 2.5mm; Voltage Rating (DC): 50V; Package Quantity: 1; Weight: 0.005644oz; Series: K; Mount: Through Hole; Termination: Radial; Height - Seated (Max): 0.257inch; Length: 4mm; Packaging: Tape and Reel; Width: 2.5mm; RoHS Compliant: Yes
D7 = 1N4148: as D4 on sheet Buck Converter; Reverse Voltage: 100V; Output Current: 200mA; Average Rectified Current: 200mA; Diameter: 1.91mm; Max Repetitive Reverse Voltage (Vrrm): 100V; Current Rating: 200mA; Case/Package: DO-35; Lead Free: Lead Free; Number of Pins: 2; Recovery Time: 4ns; Packaging: Bulk; Contact Plating: Tin; Voltage: 100V; Mount: Through Hole; Max Surge Current: 4A; Package Quantity: 2000; Width: 1.91mm; Max Reverse Voltage (DC): 100V; Length: 4.56mm; Radiation Hardening: No; Power Dissipation: 500mW; Voltage Rating (DC): 100V; Peak Non-Repetitive Surge Current: 4A; REACH SVHC: No SVHC; Height: 4.56mm; Max Operating Temperature: 175°C; Series: -; Weight: 0.01lb; Min Operating Temperature: -65°C
Q4 Q5 = 2N3904: General Purpose Transistor, NPN Silicon, 200 mA, 60 V, -55 to 150 degC, 3-Pin TO-92, RoHS, Bulk; Manufacturer: ONSemiconductor; Emitter- Base Voltage VEBO: 6V; Maximum Power Dissipation: 625mW; Maximum DC Collector Current: 0.2A; Collector- Emitter Voltage VCEO Max: 40V; Collector- Base Voltage VCBO: 60V; DC Collector/Base Gain hfe Min: 60; Configuration: Single; Collector-Emitter Saturation Voltage: 0.3V; Gain Bandwidth Product fT: 270MHz; Mounting Style: ThroughHole; Package / Case: TO-92-3(TO-226); Mounting Technology: ThroughHole; Minimum Operating Temperature: -65C; Datasheet Version: Rev. 8, 08/2012; Product Category: BipolarTransistors-BJT; Factory Pack Quantity: 5000; Transistor Polarity: NPN; Package Description: 3-Pin Transistor Outline, Body 4.825 x 3.685 mm, Pitch 1.27 mm; RoHS: Details; Datasheet URL: https://datasheet.ciiva.com/4725/2n3903-d-285841-4725808.pdf; Packaging: Bulk; Maximum Operating Temperature: +150C; Package Reference: TO-92-3-29-11; Brand: ONSemiconductor; Manufacturer URL: http://www.onsemi.com/
R10-R18 = Resistor: as R1 on sheet EECS498Converter; Military Standard: MIL-PRF-39017; REACH SVHC: Unknown; Min Operating Temperature: -65°C; Length: 7.62mm; Case/Package: Axial; Lead Free: Contains Lead; Height: 2.5mm; Contact Plating: Lead, Tin; Radiation Hardening: No; Composition: Metal Film; Voltage Rating (DC): 250V; Schedule B: 8533210090, 8533210090|8533210090, 8533210090|8533210090|8533210090, 8533210090|8533210090|8533210090|8533210090; Diameter: 2.29mm; Tolerance: 1%; Max Operating Temperature: 150°C; Number of Terminations: 2; RoHS: Non-Compliant; Features: Military, Moisture Resistant, Weldable; Power Rating: 250mW; Packaging: Bulk; Width: 2.29mm; Termination: Axial; Failure Rate: 0.001%
U4 = LM319N: as U5 on sheet Constant Current Controller; ComponentLink1Description: Datasheet URL; PinCount: 14; PackageDescription: MDIP, .750 x .250 x.130in, 14 Lead, .100in Pitch; ComponentLink1URL: http://www.ti.com/general/docs/lit/getliterature.tsp?genericPartNumber=LM319-N&fileType=pdf; Package Reference: NFF0014A; RoHS: N; Code_JEDEC: MS-001-AA

## Sheet Dimming.SchDoc
size B; Organization: MASA; SheetNumber: 7; SheetTotal: 7
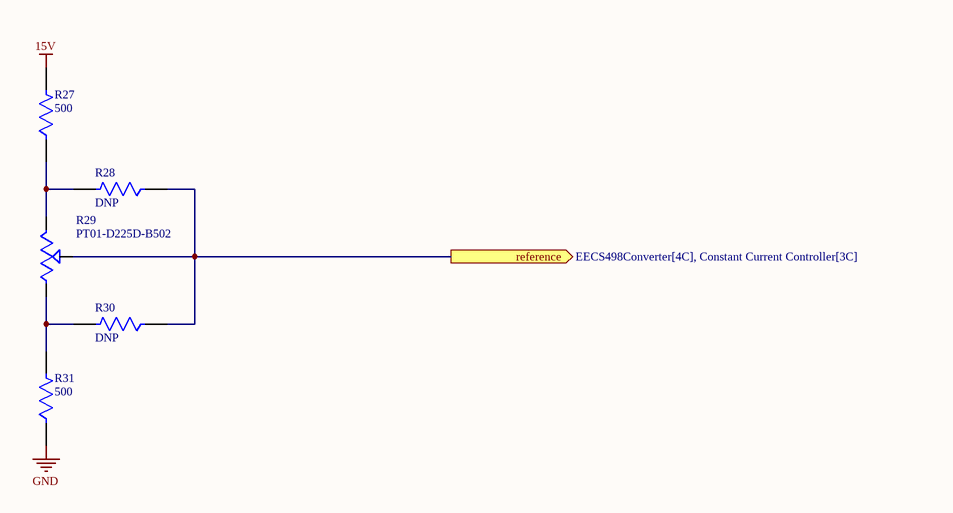
[diagram p5: Dimming.SchDoc]

### Parts
R27  500  [FP-RLR07-MFG]
R28  DNP  [FP-RLR07-MFG]
R29  PT01-D225D-B502  [TRIM_PT01-D225D-B502]
R30  DNP  [FP-RLR07-MFG]
R31  500  [FP-RLR07-MFG]

### Ports
reference (out, see EECS498Converter[4C], Constant Current Controller[3C])

### Nets
15V: R27.2
GND: R31.1
NetC32_1: R28.1 R29.2 R30.1 ; port reference
NetR27_1: R27.1 R28.2 R29.1
NetR29_3: R29.3 R30.2 R31.2

### Notes on the sheet
- Michigan Aeronautical Science Association
- University of Michigan, Ann Arbor
- Size: B

### Library data of the parts
R27 R28 R30 R31 = Resistor: as R1 on sheet EECS498Converter; Military Standard: MIL-PRF-39017; REACH SVHC: Unknown; Min Operating Temperature: -65°C; Length: 7.62mm; Case/Package: Axial; Lead Free: Contains Lead; Height: 2.5mm; Contact Plating: Lead, Tin; Radiation Hardening: No; Composition: Metal Film; Voltage Rating (DC): 250V; Schedule B: 8533210090, 8533210090|8533210090, 8533210090|8533210090|8533210090, 8533210090|8533210090|8533210090|8533210090; Diameter: 2.29mm; Tolerance: 1%; Max Operating Temperature: 150°C; Number of Terminations: 2; RoHS: Non-Compliant; Features: Military, Moisture Resistant, Weldable; Power Rating: 250mW; Packaging: Bulk; Width: 2.29mm; Termination: Axial; Failure Rate: 0.001%
R29 = PT01-D225D-B502: Value: *; MP: PT01-D225D-B502; Availability: Unavailable; Package: None; Price: None

## Sheet Sawtooth Generator.SchDoc
size B; SheetNumber: 4; SheetTotal: 7
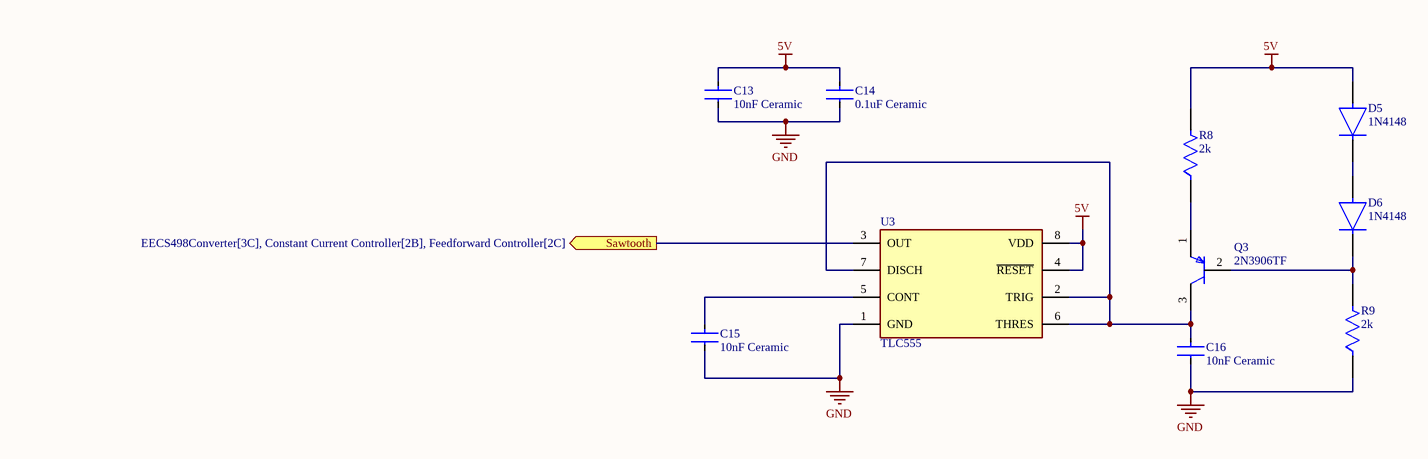
[diagram p6: Sawtooth Generator.SchDoc]

### Parts
C13  10nF Ceramic  [FP-K15H5-MFG]
C14  0.1uF Ceramic  [FP-K15H5-MFG]
C15  10nF Ceramic  [FP-K15H5-MFG]
C16  10nF Ceramic  [FP-K15H5-MFG]
D5  1N4148  [FP-1N4148-MFG]
D6  1N4148  [FP-1N4148-MFG]
Q3  2N3906TF  [2N3906TF]
R8  2k  [FP-RLR07-MFG]
R9  2k  [FP-RLR07-MFG]
U3  TLC555  [DIP8]

### Ports
Sawtooth (out, see EECS498Converter[3C], Constant Current Controller[2B], Feedforward Controller[2C])

### Nets
5V: C13.1 C14.1 D5.2(A) R8.2 U3.4(~{RESET}) U3.8(VDD)
GND: C13.2 C14.2 C15.2 C16.2 R9.1 U3.1(GND)
NetC15_1: C15.1 U3.5(CONT)
NetC16_1: C16.1 Q3.3(C) U3.2(TRIG) U3.6(THRES) U3.7(DISCH)
NetD5_1: D5.1(C) D6.2(A)
NetD6_1: D6.1(C) Q3.2(B) R9.2
NetQ3_1: Q3.1(E) R8.1
NetR17_2: U3.3(OUT) ; port Sawtooth

### Library data of the parts
C13 C15 C16 = 10nF Capacitor: as C5 on sheet Boost Converter; Diameter: 500um; Max Operating Temperature: 125°C; Dielectric Material: Ceramic; Case/Package: Dipped; Dielectric: X7R; Lead Free: Lead Free; Construction: RADIAL; Voltage: 50V; Thickness: 2.6mm; Min Operating Temperature: -55°C; Lead Pitch: 5mm; Height: 4mm; Radiation Hardening: No; Voltage Rating: 50V; Depth: 2.5mm; Voltage Rating (DC): 50V; Package Quantity: 1; Weight: 0.005644oz; Series: K; Mount: Through Hole; Termination: Radial; Height - Seated (Max): 0.257inch; Length: 4mm; Packaging: Tape and Reel; Width: 2.5mm; RoHS Compliant: Yes
C14 = 0.1uF Capacitor: as C6 on sheet Boost Converter; Diameter: 500um; Max Operating Temperature: 125°C; Dielectric Material: Ceramic; Case/Package: Dipped; Dielectric: X7R; Lead Free: Lead Free; Construction: RADIAL; Voltage: 50V; Thickness: 2.6mm; Min Operating Temperature: -55°C; Lead Pitch: 5mm; Height: 4mm; Radiation Hardening: No; Voltage Rating: 50V; Depth: 2.5mm; Voltage Rating (DC): 50V; Package Quantity: 1; Weight: 0.005644oz; Series: K; Mount: Through Hole; Termination: Radial; Height - Seated (Max): 0.257inch; Length: 4mm; Packaging: Tape and Reel; Width: 2.5mm; RoHS Compliant: Yes
D5 D6 = 1N4148: as D4 on sheet Buck Converter; Reverse Voltage: 100V; Output Current: 200mA; Average Rectified Current: 200mA; Diameter: 1.91mm; Max Repetitive Reverse Voltage (Vrrm): 100V; Current Rating: 200mA; Case/Package: DO-35; Lead Free: Lead Free; Number of Pins: 2; Recovery Time: 4ns; Packaging: Bulk; Contact Plating: Tin; Voltage: 100V; Mount: Through Hole; Max Surge Current: 4A; Package Quantity: 2000; Width: 1.91mm; Max Reverse Voltage (DC): 100V; Length: 4.56mm; Radiation Hardening: No; Power Dissipation: 500mW; Voltage Rating (DC): 100V; Peak Non-Repetitive Surge Current: 4A; REACH SVHC: No SVHC; Height: 4.56mm; Max Operating Temperature: 175°C; Series: -; Weight: 0.01lb; Min Operating Temperature: -65°C
Q3 = 2N3906TF: 2N3906TF Small Signal Bipolar Transistor, 0.2A I(C), 40V V(BR)CEO, 1-Element, PNP, Silicon, TO-92; NexarPartId: 84408866; Manufacturer Lifecycle Status: ACTIVE; Collector Base Voltage (VCBO): -40V; Frequency: 250MHz; Number of Elements: 1; Max Power Dissipation: 625mW; Max Breakdown Voltage: 160V; Current Rating: -200mA; Emitter Base Voltage (VEBO): -5V; Collector Emitter Saturation Voltage: -400mV; Element Configuration: Single; Max Junction Temperature (Tj): 150°C; hFE Min: 100; Polarity: PNP; Lead Free: Lead Free; RoHS: Compliant; Max Operating Temperature: 150°C; Collector Emitter Voltage (VCEO): -40V; Max Frequency: 250MHz; Power Dissipation: 625mW; Height: 5.33mm; Schedule B: 8541210080; Mount: Through Hole; Length: 5.2mm; REACH SVHC: No SVHC; Min Operating Temperature: -55°C; Gain Bandwidth Product: 250MHz; Number of Pins: 3; Lifecycle Status: Production; Transition Frequency: 250MHz; Collector Emitter Breakdown Voltage: -40V; Case/Package: TO-92; Packaging: Tape and Reel; Width: 4.19mm; Max Collector Current: -200mA; Radiation Hardening: No; Weight: 240mg; Voltage Rating (DC): -40V
R8 R9 = Resistor: as R1 on sheet EECS498Converter; Military Standard: MIL-PRF-39017; REACH SVHC: Unknown; Min Operating Temperature: -65°C; Length: 7.62mm; Case/Package: Axial; Lead Free: Contains Lead; Height: 2.5mm; Contact Plating: Lead, Tin; Radiation Hardening: No; Composition: Metal Film; Voltage Rating (DC): 250V; Schedule B: 8533210090, 8533210090|8533210090, 8533210090|8533210090|8533210090, 8533210090|8533210090|8533210090|8533210090; Diameter: 2.29mm; Tolerance: 1%; Max Operating Temperature: 150°C; Number of Terminations: 2; RoHS: Non-Compliant; Features: Military, Moisture Resistant, Weldable; Power Rating: 250mW; Packaging: Bulk; Width: 2.29mm; Termination: Axial; Failure Rate: 0.001%
U3 = TLC555: IC OSC SGL TIMER 2.1MHZ 8-SOIC; Min Supply Voltage: 2V; Number of Channels: 1; Max Power Dissipation: 725mW; Max Supply Voltage: 15V; Low Level Output Current: 100mA; Current Rating: 250A; Quiescent Current: 250uA; Operating Supply Current: 360uA; High Level Output Current: -10mA; Width: 3.91mm; Case/Package: SOIC; Weight: 0.002561oz; Frequency: 2.1MHz; Height: 1.58mm; Package Quantity: 2500; REACH SVHC: No SVHC; Number of Timers/Counters: 1; Lead Free: Lead Free; Number of Pins: 8; Max Operating Temperature: 125°C; Min Operating Temperature: -40°C; Length: 4.9mm; Radiation Hardening: No; Packaging: Tape and Reel; Termination: SMD/SMT; Mount: Surface Mount; Power Dissipation: 725mW

## Nets that join several sheets
5V: EECS498Converter (J9.1), Constant Current Controller (R19.2), Feedforward Controller (Q4.3 R10.2 R16.2), Sawtooth Generator (6 pins)
15V: EECS498Converter (J11.1), Dimming (R27.2)
GND: EECS498Converter (11 pins), Boost Converter (10 pins), Buck Converter (8 pins), Constant Current Controller (15 pins), Feedforward Controller (10 pins), Dimming (R31.1), Sawtooth Generator (6 pins)
NetC2_1: EECS498Converter (J3.1 TP3.1), Boost Converter (C2.1 L1.1), Feedforward Controller (R11.2)
NetC3_1: EECS498Converter (D1.2 J6.1 R1.1), Boost Converter (C3.1 C4.1 D2.1)
NetC7_1: EECS498Converter (J4.1 TP4.1), Buck Converter (C7.1 C8.1 L2.2)
NetC7_2: EECS498Converter (J7.1 TP6.1), Buck Converter (C7.2 C8.2 R5.2), Constant Current Controller (R24.2)
NetC32_1: Constant Current Controller (C32.1 R25.1), Dimming (R28.1 R29.2 R30.1)
NetJ1_1: EECS498Converter (J1.1 R2.2), Buck Converter (Q2.2)
NetR16_1: Boost Converter (TP12.1), Feedforward Controller (R16.1 R18.1 U4.12)
NetR17_2: EECS498Converter (TP9.1), Constant Current Controller (U5.5), Feedforward Controller (R17.2), Sawtooth Generator (U3.3)
NetR19_1: Buck Converter (TP34.1), Constant Current Controller (R19.1 R20.2 U5.12)